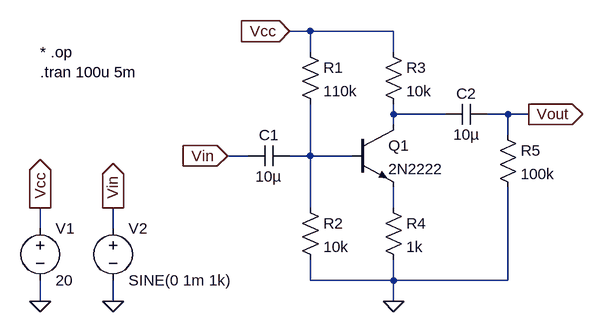
[diagram p0: schematic amplifier.asc]
amplifier.asc, the LTspice schematic file:
Version 4
SHEET 1 880 680
WIRE 256 96 224 96
WIRE 384 96 256 96
WIRE 256 128 256 96
WIRE 384 128 384 96
WIRE 384 224 384 208
WIRE 464 224 384 224
WIRE 560 224 528 224
WIRE 592 224 560 224
WIRE 384 240 384 224
WIRE 560 256 560 224
WIRE 160 288 128 288
WIRE 256 288 256 208
WIRE 256 288 224 288
WIRE 320 288 256 288
WIRE 256 368 256 288
WIRE 384 368 384 336
WIRE -160 400 -160 368
WIRE -48 400 -48 368
WIRE 256 480 256 448
WIRE 384 480 384 448
WIRE 384 480 256 480
WIRE 560 480 560 336
WIRE 560 480 384 480
WIRE -160 512 -160 480
WIRE -48 512 -48 480
WIRE 384 512 384 480
FLAG 384 512 0
FLAG 224 96 Vcc
IOPIN 224 96 In
FLAG 128 288 Vin
IOPIN 128 288 In
FLAG 592 224 Vout
IOPIN 592 224 Out
FLAG -160 512 0
FLAG -160 368 Vcc
IOPIN -160 368 Out
FLAG -48 512 0
FLAG -48 368 Vin
IOPIN -48 368 Out
SYMBOL npn 320 240 R0
SYMATTR InstName Q1
SYMATTR Value 2N2222
SYMBOL res 240 112 R0
SYMATTR InstName R1
SYMATTR Value 110k
SYMBOL res 240 352 R0
SYMATTR InstName R2
SYMATTR Value 10k
SYMBOL res 368 112 R0
SYMATTR InstName R3
SYMATTR Value 10k
SYMBOL res 368 352 R0
SYMATTR InstName R4
SYMATTR Value 1k
SYMBOL res 544 240 R0
SYMATTR InstName R5
SYMATTR Value 100k
SYMBOL cap 224 272 R90
WINDOW 0 0 32 VBottom 2
WINDOW 3 32 32 VTop 2
SYMATTR InstName C1
SYMATTR Value 10µ
SYMBOL cap 528 208 R90
WINDOW 0 0 32 VBottom 2
WINDOW 3 32 32 VTop 2
SYMATTR InstName C2
SYMATTR Value 10µ
SYMBOL voltage -160 384 R0
SYMATTR InstName V1
SYMATTR Value 20
SYMBOL voltage -48 384 R0
SYMATTR InstName V2
SYMATTR Value SINE(0 1m 1k)
TEXT -160 128 Left 2 !* .op\n.tran 100u 5m

The netlist it stands for:
* amplifier.asc
Q1 N001 N002 N003 0 2N2222
R1 Vcc N002 110k
R2 N002 0 10k
R3 Vcc N001 10k
R4 N003 0 1k
R5 Vout 0 100k
C1 N002 Vin 10µ
C2 Vout N001 10µ
V1 Vcc 0 20
V2 Vin 0 SINE(0 1m 1k)
.model NPN NPN
.model PNP PNP
.lib standard.bjt
* .op
.tran 100u 5m
.backanno
.end